# Altium schematic sheet 0063_HDMI1_CONNECTOR.SchDoc
size A3
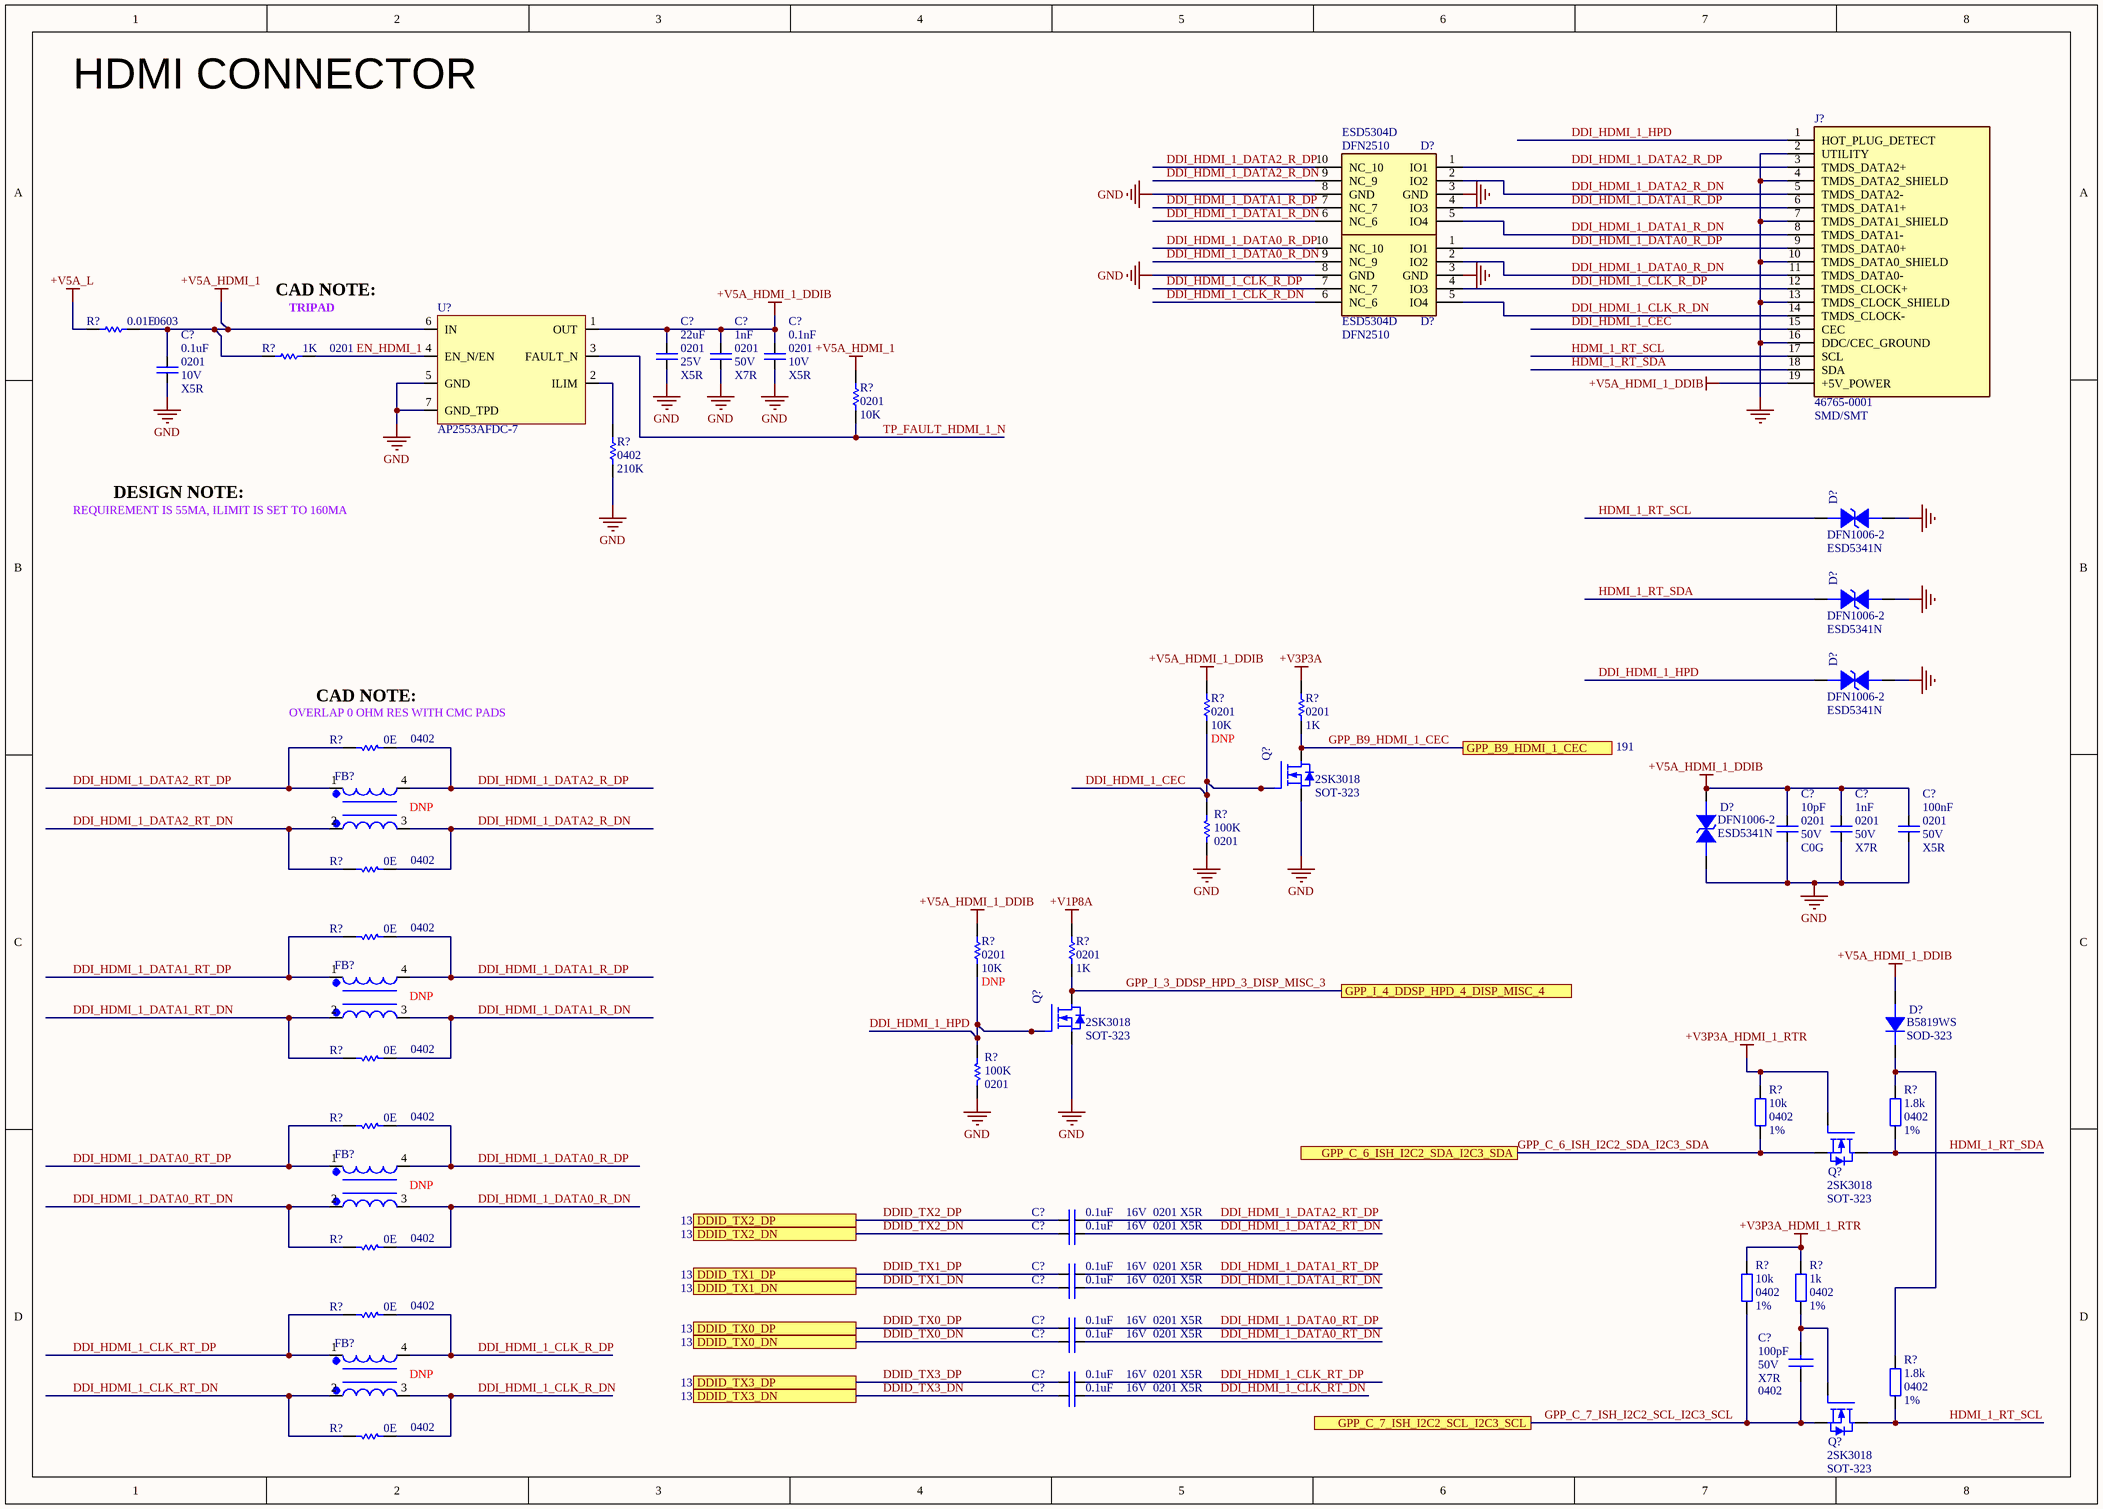
[diagram p0: 0063_HDMI1_CONNECTOR.SchDoc]

## Parts
(Parts that share a designator on the sheet are numbered #1, #2 ... from top to bottom, then left to right.)
C?#1  value 22uF  Case/Package: 0201  Voltage: 25V  Dielectric: X5R  [CAPC0805]
C?#2  value 1nF  Case/Package: 0201  Voltage: 50V  Dielectric: X7R  [CAPC0201]
C?#3  value 0.1nF  Case/Package: 0201  Voltage: 10V  Dielectric: X5R  [CAPC0201]
C?#4  value 0.1uF  Case/Package: 0201  Voltage: 10V  Dielectric: X5R  [CAPC0201]
C?#5  value 10pF  Case/Package: 0201  Voltage: 50V  Dielectric: C0G  [CAPC0201]
C?#6  value 1nF  Case/Package: 0201  Voltage: 50V  Dielectric: X7R  [CAPC0201]
C?#7  value 100nF  Case/Package: 0201  Voltage: 50V  Dielectric: X5R  [CAPC0201]
C?#8  value 0.1uF  Case/Package: 0201  Voltage: 16V  Dielectric: X5R  [CAPC0201]
C?#9  value 0.1uF  Case/Package: 0201  Voltage: 16V  Dielectric: X5R  [CAPC0201]
C?#10  value 0.1uF  Case/Package: 0201  Voltage: 16V  Dielectric: X5R  [CAPC0201]
C?#11  value 0.1uF  Case/Package: 0201  Voltage: 16V  Dielectric: X5R  [CAPC0201]
C?#12  value 0.1uF  Case/Package: 0201  Voltage: 16V  Dielectric: X5R  [CAPC0201]
C?#13  value 0.1uF  Case/Package: 0201  Voltage: 16V  Dielectric: X5R  [CAPC0201]
C?#14  value 0.1uF  Case/Package: 0201  Voltage: 16V  Dielectric: X5R  [CAPC0201]
C?#15  value 100pF  Voltage: 50V  Dielectric: X7R  Case/Package: 0402  [CAPC0402]
C?#16  value 0.1uF  Case/Package: 0201  Voltage: 16V  Dielectric: X5R  [CAPC0201]
D?#1  Case/Package: DFN2510  [DFN2510-10]  (hidden comment: ESD5304D)
D?#2  Case/Package: DFN2510  [DFN2510-10]  (hidden comment: ESD5304D)
D?#3  Case/Package: DFN1006-2  [DFN-2_1.0X0.6]  (hidden comment: ESD5341N)
D?#4  Case/Package: DFN1006-2  [DFN-2_1.0X0.6]  (hidden comment: ESD5341N)
D?#5  Case/Package: DFN1006-2  [DFN-2_1.0X0.6]  (hidden comment: ESD5341N)
D?#6  Case/Package: DFN1006-2  [DFN-2_1.0X0.6]  (hidden comment: ESD5341N)
D?#7  Manufacturer Part Number: B5819WS  [SOD-323]  (hidden comment: DIODE_B5819WS)
FB?#1  WCM3216F2SF-900T04  [CHOKE]  (value not drawn)
FB?#2  WCM3216F2SF-900T04  [CHOKE]  (value not drawn)
FB?#3  WCM3216F2SF-900T04  [CHOKE]  (value not drawn)
FB?#4  WCM3216F2SF-900T04  [CHOKE]  (value not drawn)
J?  Manufacturer Part Number: 46765-0001  Case/Package: SMD/SMT  [HDMI MICRO]  (hidden comment: Micro HDMI Conn)
Q?#1  Manufacturer Part Number: 2SK3018  Case/Package: SOT-323  [SOT323]  (hidden comment: MOSFET N_2SK3018)
Q?#2  Manufacturer Part Number: 2SK3018  Case/Package: SOT-323  [SOT323]  (hidden comment: MOSFET N_2SK3018)
Q?#3  Manufacturer Part Number: 2SK3018  Case/Package: SOT-323  [SOT323]  (hidden comment: MOSFET N_2SK3018)
Q?#4  Manufacturer Part Number: 2SK3018  Case/Package: SOT-323  [SOT323]  (hidden comment: MOSFET N_2SK3018)
R?#1  value 0.01E  Case/Package: 0603  [RESC0603]  (hidden comment: Res)
R?#2  value 1K  Case/Package: 0201  [RESC0201]  (hidden comment: Res)
R?#3  value 10K  Case/Package: 0201  [RESC0201]  (hidden comment: Res)
R?#4  value 210K  Case/Package: 0402  [RESC0402]  (hidden comment: Res)
R?#5  value 10K  Case/Package: 0201  [RESC0201]  (hidden comment: Res)
R?#6  value 1K  Case/Package: 0201  [RESC0201]  (hidden comment: Res)
R?#7  value 0E  Case/Package: 0402  [RESC0402]  (hidden comment: Res)
R?#8  value 100K  Case/Package: 0201  [RESC0201]  (hidden comment: Res)
R?#9  value 0E  Case/Package: 0402  [RESC0402]  (hidden comment: Res)
R?#10  value 0E  Case/Package: 0402  [RESC0402]  (hidden comment: Res)
R?#11  value 10K  Case/Package: 0201  [RESC0201]  (hidden comment: Res)
R?#12  value 1K  Case/Package: 0201  [RESC0201]  (hidden comment: Res)
R?#13  value 0E  Case/Package: 0402  [RESC0402]  (hidden comment: Res)
R?#14  value 100K  Case/Package: 0201  [RESC0201]  (hidden comment: Res)
R?#15  value 10k  Case/Package: 0402  Tolerance: 1%  [RESC0402]
R?#16  value 1.8k  Case/Package: 0402  Tolerance: 1%  [RESC0402]
R?#17  value 0E  Case/Package: 0402  [RESC0402]  (hidden comment: Res)
R?#18  value 0E  Case/Package: 0402  [RESC0402]  (hidden comment: Res)
R?#19  value 10k  Case/Package: 0402  Tolerance: 1%  [RESC0402]
R?#20  value 1k  Case/Package: 0402  Tolerance: 1%  [RESC0402]
R?#21  value 0E  Case/Package: 0402  [RESC0402]  (hidden comment: Res)
R?#22  value 1.8k  Case/Package: 0402  Tolerance: 1%  [RESC0402]
R?#23  value 0E  Case/Package: 0402  [RESC0402]  (hidden comment: Res)
U?  AP2553AFDC-7

## Ports
DDID_TX0_DN, DDID_TX0_DP, DDID_TX1_DN, DDID_TX1_DP, DDID_TX2_DN, DDID_TX2_DP, DDID_TX3_DN, DDID_TX3_DP, GPP_B9_HDMI_1_CEC, GPP_C_6_ISH_I2C2_SDA_I2C3_SDA, GPP_C_7_ISH_I2C2_SCL_I2C3_SCL, GPP_I_4_DDSP_HPD_4_DISP_MISC_4

## Nets
+V1P8A: R?#12.2
+V3P3A: R?#6.2
+V3P3A_HDMI_1_RTR: Q?#3.1(GATE) R?#15.2 R?#19.2 R?#20.2
+V5A_HDMI_1: C?#4.2 R?#1.1 R?#2.2 R?#3.2 U?.6(IN)
+V5A_HDMI_1_DDIB: C?#1.1 C?#2.1 C?#3.1 C?#5.1 C?#6.1 C?#7.1 D?#6.2 D?#7.1(A) J?.19(+5V_POWER) R?#5.2 R?#11.2 U?.1(OUT)
+V5A_L: R?#1.2
GND: C?#1.2 C?#2.2 C?#3.2 C?#4.1 C?#5.2 C?#6.2 C?#7.2 D?#1.3(GND) D?#1.8(GND) D?#2.3(GND) D?#2.8(GND) D?#3.1 D?#4.1 D?#5.1 D?#6.1 J?.2(UTILITY) J?.4(TMDS_DATA2_SHIELD) J?.7(TMDS_DATA1_SHIELD) J?.10(TMDS_DATA0_SHIELD) J?.13(TMDS_CLOCK_SHIELD) J?.16(DDC/CEC_GROUND) Q?#1.2(SOURCE) Q?#2.2(SOURCE) R?#4.1 R?#8.1 R?#14.1 U?.5(GND) U?.7(GND_TPD)
DDI_HDMI_1_CEC: J?.15(CEC) Q?#1.1(GATE) R?#5.1 R?#8.2
DDI_HDMI_1_CLK_R_DN: D?#2.5(IO4) D?#2.6(NC_6) FB?#4.3 J?.14(TMDS_CLOCK-) R?#23.2
DDI_HDMI_1_CLK_R_DP: D?#2.4(IO3) D?#2.7(NC_7) FB?#4.4 J?.12(TMDS_CLOCK+) R?#21.2
DDI_HDMI_1_CLK_RT_DN: C?#16.2 FB?#4.2 R?#23.1
DDI_HDMI_1_CLK_RT_DP: C?#14.2 FB?#4.1 R?#21.1
DDI_HDMI_1_DATA0_R_DN: D?#2.2(IO2) D?#2.9(NC_9) FB?#3.3 J?.11(TMDS_DATA0-) R?#18.2
DDI_HDMI_1_DATA0_R_DP: D?#2.1(IO1) D?#2.10(NC_10) FB?#3.4 J?.9(TMDS_DATA0+) R?#17.2
DDI_HDMI_1_DATA0_RT_DN: C?#13.2 FB?#3.2 R?#18.1
DDI_HDMI_1_DATA0_RT_DP: C?#12.2 FB?#3.1 R?#17.1
DDI_HDMI_1_DATA1_R_DN: D?#1.5(IO4) D?#1.6(NC_6) FB?#2.3 J?.8(TMDS_DATA1-) R?#13.2
DDI_HDMI_1_DATA1_R_DP: D?#1.4(IO3) D?#1.7(NC_7) FB?#2.4 J?.6(TMDS_DATA1+) R?#10.2
DDI_HDMI_1_DATA1_RT_DN: C?#11.2 FB?#2.2 R?#13.1
DDI_HDMI_1_DATA1_RT_DP: C?#10.2 FB?#2.1 R?#10.1
DDI_HDMI_1_DATA2_R_DN: D?#1.2(IO2) D?#1.9(NC_9) FB?#1.3 J?.5(TMDS_DATA2-) R?#9.2
DDI_HDMI_1_DATA2_R_DP: D?#1.1(IO1) D?#1.10(NC_10) FB?#1.4 J?.3(TMDS_DATA2+) R?#7.2
DDI_HDMI_1_DATA2_RT_DN: C?#9.2 FB?#1.2 R?#9.1
DDI_HDMI_1_DATA2_RT_DP: C?#8.2 FB?#1.1 R?#7.1
DDI_HDMI_1_HPD: D?#5.2 J?.1(HOT_PLUG_DETECT) Q?#2.1(GATE) R?#11.1 R?#14.2
DDID_TX0_DN: C?#13.1 ; port DDID_TX0_DN
DDID_TX0_DP: C?#12.1 ; port DDID_TX0_DP
DDID_TX1_DN: C?#11.1 ; port DDID_TX1_DN
DDID_TX1_DP: C?#10.1 ; port DDID_TX1_DP
DDID_TX2_DN: C?#9.1 ; port DDID_TX2_DN
DDID_TX2_DP: C?#8.1 ; port DDID_TX2_DP
DDID_TX3_DN: C?#16.1 ; port DDID_TX3_DN
DDID_TX3_DP: C?#14.1 ; port DDID_TX3_DP
EN_HDMI_1: R?#2.1 U?.4(EN_N/EN)
GPP_B9_HDMI_1_CEC: Q?#1.3(DRAIN) R?#6.1 ; port GPP_B9_HDMI_1_CEC
GPP_C_6_ISH_I2C2_SDA_I2C3_SDA: Q?#3.2(SOURCE) R?#15.1 ; port GPP_C_6_ISH_I2C2_SDA_I2C3_SDA
GPP_C_7_ISH_I2C2_SCL_I2C3_SCL: C?#15.1 Q?#4.2(SOURCE) R?#19.1 ; port GPP_C_7_ISH_I2C2_SCL_I2C3_SCL
GPP_I_3_DDSP_HPD_3_DISP_MISC_3: Q?#2.3(DRAIN) R?#12.1 ; port GPP_I_4_DDSP_HPD_4_DISP_MISC_4
HDMI_1_RT_SCL: D?#3.2 J?.17(SCL) Q?#4.3(DRAIN) R?#22.1
HDMI_1_RT_SDA: D?#4.2 J?.18(SDA) Q?#3.3(DRAIN) R?#16.1
TP_FAULT_HDMI_1_N: R?#3.1 U?.3(FAULT_N)
NetC?#15_2: C?#15.2 Q?#4.1(GATE) R?#20.1
NetD?#7_2: D?#7.2(K) R?#16.2 R?#22.2
NetR?#4_2: R?#4.2 U?.2(ILIM)

## Notes on the sheet
- HDMI CONNECTOR
- CAD NOTE:
- (near R?#2) TRIPAD
- REQUIREMENT IS 55MA, ILIMIT IS SET TO 160MA
- DESIGN NOTE:
- (near R?#7) OVERLAP 0 OHM RES WITH CMC PADS
- (near R?#7) CAD NOTE:

## Library data of the parts
C?#1 = Cap: CAP CER 22uF 25V X5R 0805
C?#2 C?#6 = Cap: CAP CER 1nF 50V X7R 0201
C?#3 = Cap: CAP CER 0.1nF 10V X5R 0201
C?#4 = Cap: CAP CER 0.1uF 10V X5R 0201
C?#5 = Cap: CAP CER 10pF 50V C0G 0201
C?#7 = Cap: CAP CER 100nF 50V X5R 0201
C?#8-C?#14 C?#16 = Cap: CAP CER 0.1uF 16V X5R 0201
C?#15 = Cap: CAP CER 100pF 50V X7R 0402; Manufacturer Part Number: *
D?#1 D?#2 = ESD5304D: 4-Lines, Uni-directional, Ultra-low Capacitance Transient Voltage Suppressors; Manufacturer Part Number: ESD5304D
D?#3-D?#6 = ESD5341N: 1-Line, Bi-directional, Transient Voltage Suppressors.1pF.; Manufacturer Part Number: ESD5341N
D?#7 = DIODE_B5819WS: Schottky Barrier£¬B5819WS SOD-323; Case/Package: SOD-323
FB?#1-FB?#4 = WCM3216F2SF-900T04: Power, Signal Line 90 Ohms @ 100MHz 300 mOhm 50V SMD,3.2x1.6x2mm Common Mode Filters RoHS; Manufacturer Part Number: WCM3216F2SF-900T04; Case/Package: 3.2x1.6x2mm; DNP: DNP
J? = Micro HDMI Conn: HDMI - Micro Receptacle Connector 19 Position Surface Mount, Right Angle
Q?#1-Q?#4 = MOSFET N_2SK3018: NMOS,2SK3018,SOT_323,Id=0.1A,Vds=30V
R?#1 = Res: Thick Film Resistor -  0.01ohm, 1%, 0603
R?#2 R?#6 R?#12 = Res: Thick Film Resistor -  1Kohm, 1%, 0201
R?#3 R?#5 R?#11 = Res: Thick Film Resistor -  10Kohm, 1%, 0201
  R?#5 R?#11: DNP: DNP
R?#4 = Res: Thick Film Resistor -  210Kohm, 1%, 0402
R?#7 R?#9 R?#10 R?#13 R?#17 R?#18 R?#21 R?#23 = Res: Thick Film Resistor -  0ohm, 1%, 0402
R?#8 R?#14 = Res: Thick Film Resistor -  100Kohm, 1%, 0201
R?#15 R?#19 = RES: Thick Film Resistor - 10k ohm, 1%, 0402; Manufacturer Part Number: *
R?#16 R?#22 = RES: Thick Film Resistor - 1.8k ohm, 1%, 0402; Manufacturer Part Number: *
R?#20 = RES: Thick Film Resistor - 1k ohm, 1%, 0402; Manufacturer Part Number: *